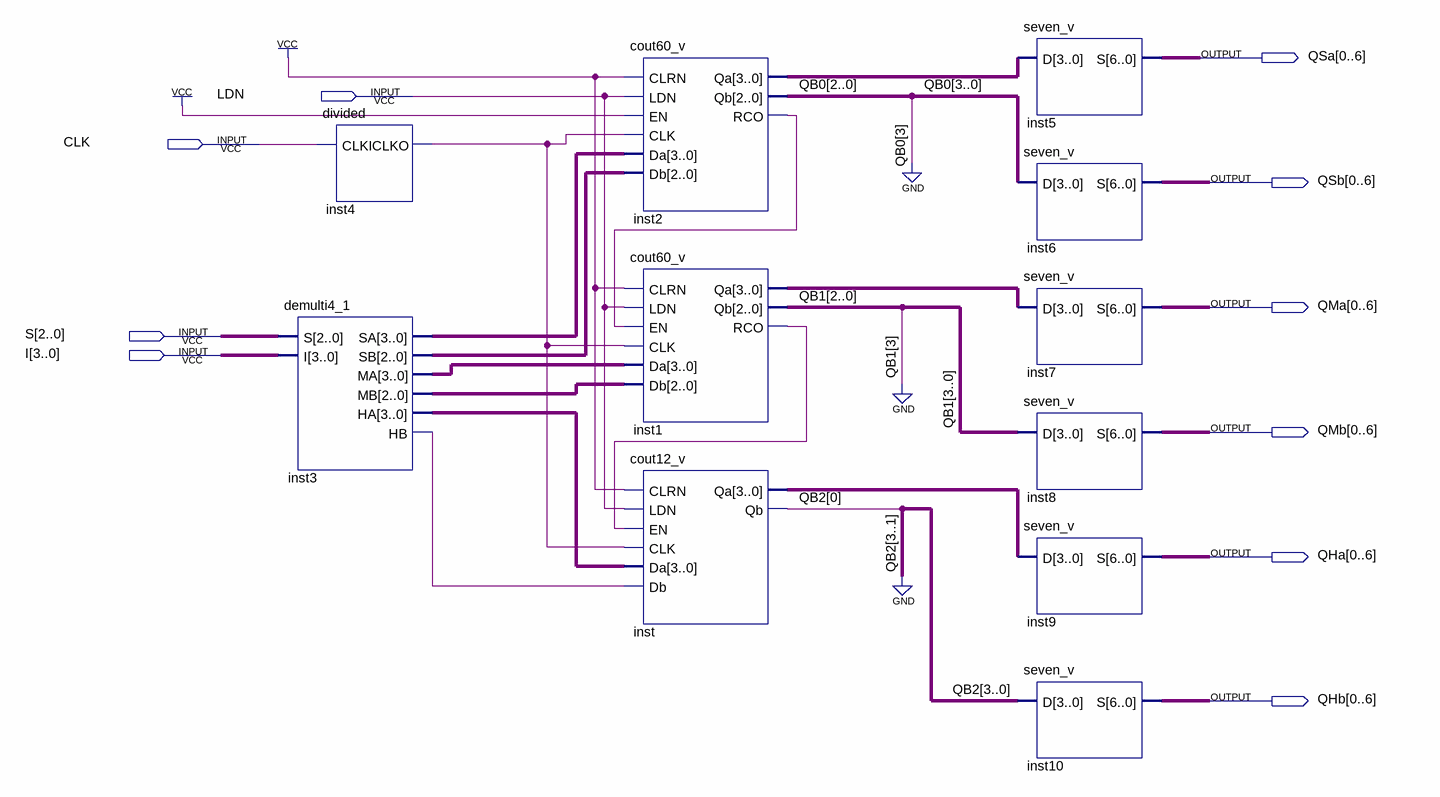
[diagram p0: schematic sheet]
// Quartus schematic D_clock.bdf as structural Verilog: 11 symbols, 10 pins
module D_clock (
  input  LDN,
  input  CLK,
  input  [2:0] S,
  input  [3:0] I,
  output [0:6] QSa,
  output [0:6] QSb,
  output [0:6] QMa,
  output [0:6] QMb,
  output [0:6] QHa,
  output [0:6] QHb
);

  wire inst1_rco, inst2_rco, inst3_hb, inst4_clko;
  wire [0:0] QB2;
  wire [2:0] inst3_mb, inst3_sb, QB0, QB1;
  wire [3:0] inst1_qa, inst2_qa, inst3_ha, inst3_ma, inst3_sa, inst_qa;

  demulti4_1 inst3 (
    .S(S), .I(I), .SA(inst3_sa), .SB(inst3_sb), .MA(inst3_ma), .MB(inst3_mb), .HA(inst3_ha), .HB(inst3_hb));
  divided inst4 (.CLKI(CLK), .CLKO(inst4_clko));
  cout60_v inst2 (
    .CLRN(1'b1), .LDN(LDN), .EN(1'b1), .CLK(inst4_clko), .Da(inst3_sa), .Db(inst3_sb), .Qa(inst2_qa),
    .Qb(QB0), .RCO(inst2_rco));
  cout60_v inst1 (
    .CLRN(1'b1), .LDN(LDN), .EN(inst2_rco), .CLK(inst4_clko), .Da(inst3_ma), .Db(inst3_mb), .Qa(inst1_qa),
    .Qb(QB1), .RCO(inst1_rco));
  cout12_v inst (
    .CLRN(1'b1), .LDN(LDN), .EN(inst1_rco), .CLK(inst4_clko), .Da(inst3_ha), .Db(inst3_hb), .Qa(inst_qa),
    .Qb(QB2[0]));
  seven_v inst5 (.D(inst2_qa), .S(QSa));
  seven_v inst6 (.D({1'b0, QB0}), .S(QSb));
  seven_v inst7 (.D(inst1_qa), .S(QMa));
  seven_v inst8 (.D({1'b0, QB1}), .S(QMb));
  seven_v inst9 (.D(inst_qa), .S(QHa));
  seven_v inst10 (.D({3'b000, QB2[0]}), .S(QHb));
endmodule
